# EAGLE design RelaisAdOn (EAGLE 8.4.3)
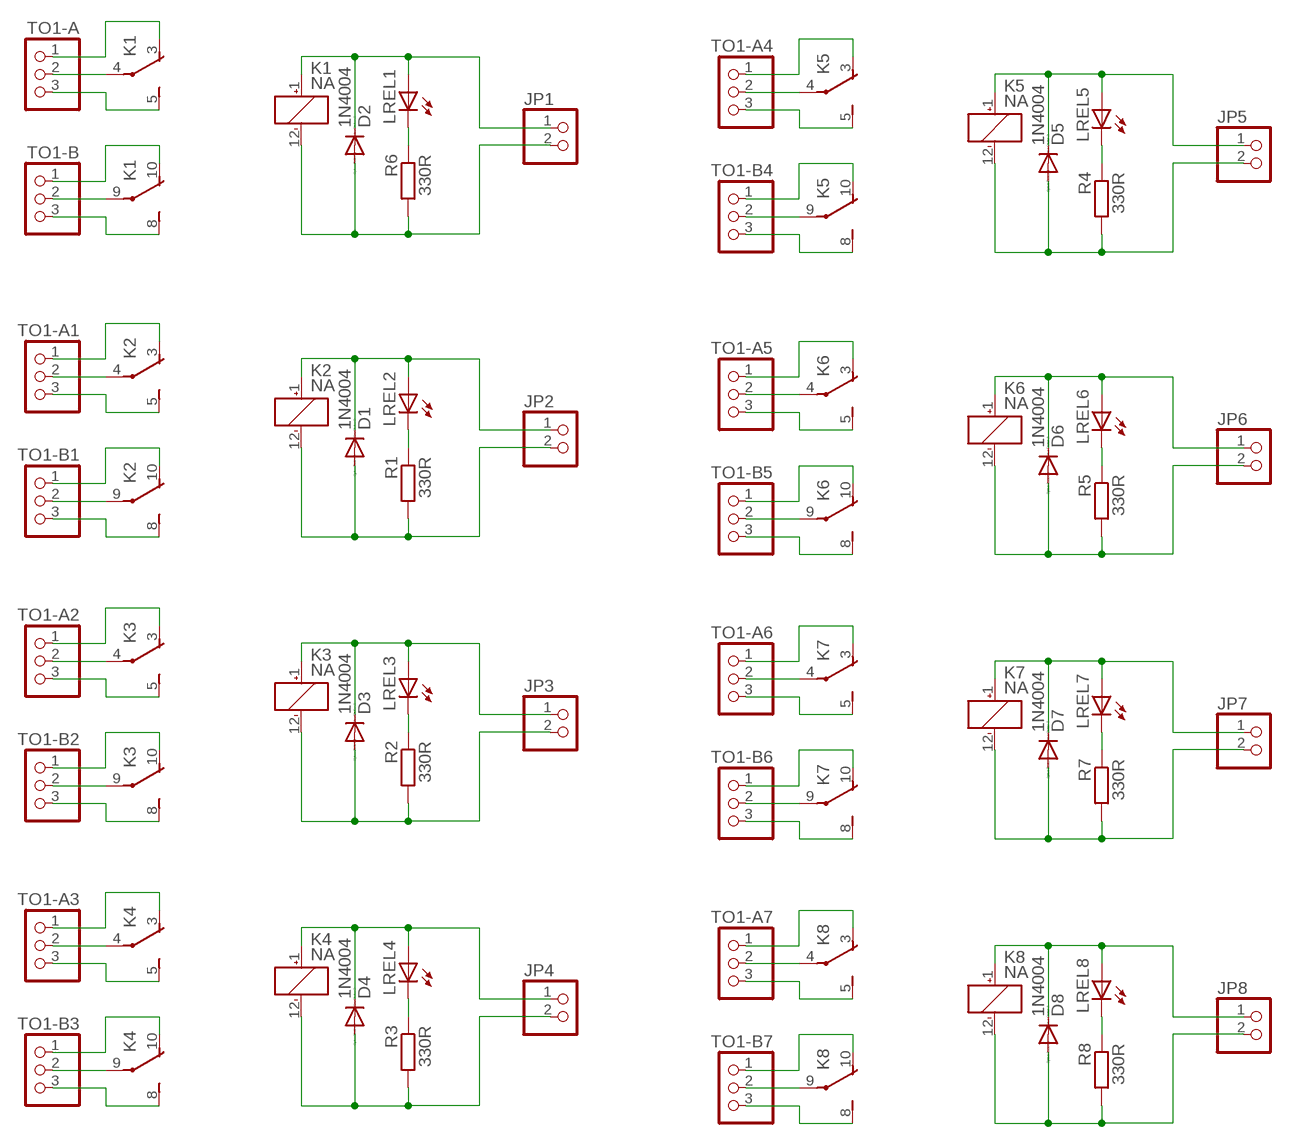
[diagram p0: schematic, sheet 1]

## Parts
D1  1N4004  [DO41-10]
D2  1N4004  [DO41-10]
D3  1N4004  [DO41-10]
D4  1N4004  [DO41-10]
D5  1N4004  [DO41-10]
D6  1N4004  [DO41-10]
D7  1N4004  [DO41-10]
D8  1N4004  [DO41-10]
JP1  PINHD-1X2  [1X02]
JP2  PINHD-1X2  [1X02]
JP3  PINHD-1X2  [1X02]
JP4  PINHD-1X2  [1X02]
JP5  PINHD-1X2  [1X02]
JP6  PINHD-1X2  [1X02]
JP7  PINHD-1X2  [1X02]
JP8  PINHD-1X2  [1X02]
K1  NA  [NA]
K2  NA  [NA]
K3  NA  [NA]
K4  NA  [NA]
K5  NA  [NA]
K6  NA  [NA]
K7  NA  [NA]
K8  NA  [NA]
LREL1  LED3MM  [LED3MM]
LREL2  LED3MM  [LED3MM]
LREL3  LED3MM  [LED3MM]
LREL4  LED3MM  [LED3MM]
LREL5  LED3MM  [LED3MM]
LREL6  LED3MM  [LED3MM]
LREL7  LED3MM  [LED3MM]
LREL8  LED3MM  [LED3MM]
R1  330R  R-EU_0207/7  [0207/7]
R2  330R  R-EU_0207/7  [0207/7]
R3  330R  R-EU_0207/7  [0207/7]
R4  330R  R-EU_0207/7  [0207/7]
R5  330R  R-EU_0207/7  [0207/7]
R6  330R  R-EU_0207/7  [0207/7]
R7  330R  R-EU_0207/7  [0207/7]
R8  330R  R-EU_0207/7  [0207/7]
TO1-A  PINHD-1X3  [1X03]
TO1-A1  PINHD-1X3  [1X03]
TO1-A2  PINHD-1X3  [1X03]
TO1-A3  PINHD-1X3  [1X03]
TO1-A4  PINHD-1X3  [1X03]
TO1-A5  PINHD-1X3  [1X03]
TO1-A6  PINHD-1X3  [1X03]
TO1-A7  PINHD-1X3  [1X03]
TO1-B  PINHD-1X3  [1X03]
TO1-B1  PINHD-1X3  [1X03]
TO1-B2  PINHD-1X3  [1X03]
TO1-B3  PINHD-1X3  [1X03]
TO1-B4  PINHD-1X3  [1X03]
TO1-B5  PINHD-1X3  [1X03]
TO1-B6  PINHD-1X3  [1X03]
TO1-B7  PINHD-1X3  [1X03]

## Nets
N$1 [Rijstroom+]: K1.4(2:P) TO1-A.2
N$2: LREL1.K(C) R6.1
N$3 [Rijstroom+]: K1.9(3:P) TO1-B.2
N$4 [Rijstroom+]: K1.8(3:S) TO1-B.3
N$5 [Rijstroom+]: K1.10(3:O) TO1-B.1
N$6 [Rijstroom+]: K1.3(2:O) TO1-A.1
N$7 [Rijstroom+]: K1.5(2:S) TO1-A.3
N$8: D2.A JP1.2 K1.12(1:-) R6.2
N$9 [5V]: D2.C JP1.1 K1.1(1:+) LREL1.A
N$10: LREL2.K(C) R1.1
N$11: D1.A JP2.2 K2.12(1:-) R1.2
N$12 [5V]: D1.C JP2.1 K2.1(1:+) LREL2.A
N$13 [Rijstroom+]: K2.4(2:P) TO1-A1.2
N$14 [Rijstroom+]: K2.9(3:P) TO1-B1.2
N$15 [Rijstroom+]: K2.8(3:S) TO1-B1.3
N$16 [Rijstroom+]: K2.10(3:O) TO1-B1.1
N$17 [Rijstroom+]: K2.3(2:O) TO1-A1.1
N$18 [Rijstroom+]: K2.5(2:S) TO1-A1.3
N$19: LREL3.K(C) R2.1
N$20: D3.A JP3.2 K3.12(1:-) R2.2
N$21 [5V]: D3.C JP3.1 K3.1(1:+) LREL3.A
N$22 [Rijstroom+]: K3.4(2:P) TO1-A2.2
N$23 [Rijstroom+]: K3.9(3:P) TO1-B2.2
N$24 [Rijstroom+]: K3.8(3:S) TO1-B2.3
N$25 [Rijstroom+]: K3.10(3:O) TO1-B2.1
N$26 [Rijstroom+]: K3.3(2:O) TO1-A2.1
N$27 [Rijstroom+]: K3.5(2:S) TO1-A2.3
N$28: LREL4.K(C) R3.1
N$29: D4.A JP4.2 K4.12(1:-) R3.2
N$30 [5V]: D4.C JP4.1 K4.1(1:+) LREL4.A
N$31 [Rijstroom+]: K4.4(2:P) TO1-A3.2
N$32 [Rijstroom+]: K4.9(3:P) TO1-B3.2
N$33 [Rijstroom+]: K4.8(3:S) TO1-B3.3
N$34 [Rijstroom+]: K4.10(3:O) TO1-B3.1
N$35 [Rijstroom+]: K4.3(2:O) TO1-A3.1
N$36 [Rijstroom+]: K4.5(2:S) TO1-A3.3
N$37: LREL5.K(C) R4.1
N$38: D5.A JP5.2 K5.12(1:-) R4.2
N$39 [5V]: D5.C JP5.1 K5.1(1:+) LREL5.A
N$40 [Rijstroom+]: K5.4(2:P) TO1-A4.2
N$41 [Rijstroom+]: K5.9(3:P) TO1-B4.2
N$42 [Rijstroom+]: K5.8(3:S) TO1-B4.3
N$43 [Rijstroom+]: K5.10(3:O) TO1-B4.1
N$44 [Rijstroom+]: K5.3(2:O) TO1-A4.1
N$45 [Rijstroom+]: K5.5(2:S) TO1-A4.3
N$46: LREL6.K(C) R5.1
N$47: D6.A JP6.2 K6.12(1:-) R5.2
N$48 [5V]: D6.C JP6.1 K6.1(1:+) LREL6.A
N$49 [Rijstroom+]: K6.4(2:P) TO1-A5.2
N$50 [Rijstroom+]: K6.9(3:P) TO1-B5.2
N$51 [Rijstroom+]: K6.8(3:S) TO1-B5.3
N$52 [Rijstroom+]: K6.10(3:O) TO1-B5.1
N$53 [Rijstroom+]: K6.3(2:O) TO1-A5.1
N$54 [Rijstroom+]: K6.5(2:S) TO1-A5.3
N$55: LREL7.K(C) R7.1
N$56: D7.A JP7.2 K7.12(1:-) R7.2
N$57 [5V]: D7.C JP7.1 K7.1(1:+) LREL7.A
N$58 [Rijstroom+]: K7.4(2:P) TO1-A6.2
N$59 [Rijstroom+]: K7.9(3:P) TO1-B6.2
N$60 [Rijstroom+]: K7.8(3:S) TO1-B6.3
N$61 [Rijstroom+]: K7.10(3:O) TO1-B6.1
N$62 [Rijstroom+]: K7.3(2:O) TO1-A6.1
N$63 [Rijstroom+]: K7.5(2:S) TO1-A6.3
N$64: LREL8.K(C) R8.1
N$65: D8.A JP8.2 K8.12(1:-) R8.2
N$66 [5V]: D8.C JP8.1 K8.1(1:+) LREL8.A
N$67 [Rijstroom+]: K8.4(2:P) TO1-A7.2
N$68 [Rijstroom+]: K8.9(3:P) TO1-B7.2
N$69 [Rijstroom+]: K8.8(3:S) TO1-B7.3
N$70 [Rijstroom+]: K8.10(3:O) TO1-B7.1
N$71 [Rijstroom+]: K8.3(2:O) TO1-A7.1
N$72 [Rijstroom+]: K8.5(2:S) TO1-A7.3

## Library data of the parts
D1-D8 = diode:1N4004: DIODE general purpose rectifier, 1 A
JP1-JP8 = pinhead:PINHD-1X2: PIN HEADER
K1-K8 = relay:NA: RELAY; OC_FARNELL: unknown; OC_NEWARK: unknown
LREL1-LREL8 = led:LED: LED OSRAM: - CHIPLED LG R971, LG N971, LY N971, LG Q971, LY Q971, LO R971, LY R971 LH N974, LH R974 LS Q976, LO Q976, LY Q976 LO Q996 - Hyper CHIPLED LW Q18S LB Q993, LB Q99A, LB R99A - SideLED LS A670, LO A670, LY A670, LG A670, LP A670 LB A673, LV A673, LT A673, LW A673 LH A674 LY A675 LS A676, LA A676, LO A676, LY A676, LW A676 LS A679, LY A679, LG A679 - Hyper Micro SIDELED® LS Y876, LA Y876, LO Y876, LY Y876 LT Y87S - SmartLED LW L88C, LW L88S LB L89C, LB L89S, LG L890 LS L89K, LO L89K, LY L89K LS L896, LA L896, LO L896, LY L896 - TOPLED LS T670, LO T670, LY T670, LG T670, LP T670 LSG T670, LSP T670, LSY T670, LOP T670, LYG T670 LG T671, LOG T671, LSG T671 LB T673, LV T673, LT T673, LW T673 LH T674 LS T676, LA T676, LO T676, LY T676, LB T676, LH T676, LSB T676, LW T676 LB T67C, LV T67C, LT T67C, LS T67K, LO T67K, LY T67K, LW E67C LS E67B, LA E67B, LO E67B, LY E67B, LB E67C, LV E67C, LT E67C LW T67C LS T679, LY T679, LG T679 LS T770, LO T770, LY T770, LG T770, LP T770 LB T773, LV T773, LT T773, LW T773 LH T774 LS E675, LA E675, LY E675, LS T675 LS T776, LA T776, LO T776, LY T776, LB T776 LHGB T686 LT T68C, LB T68C - Hyper Mini TOPLED® LB M676 - Mini TOPLED Santana® LG M470 LS M47K, LO M47K, LY M47K Source: http://www.osram.convergy.de LUXEON: - LUMILED® LXK2-PW12-R00, LXK2-PW12-S00, LXK2-PW14-U00, LXK2-PW14-V00 LXK2-PM12-R00, LXK2-PM12-S00, LXK2-PM14-U00 LXK2-PE12-Q00, LXK2-PE12-R00, LXK2-PE12-S00, LXK2-PE14-T00, LXK2-PE14-U00 LXK2-PB12-K00, LXK2-PB12-L00, LXK2-PB12-M00, LXK2-PB14-N00, LXK2-PB14-P00, LXK2-PB14-Q00 LXK2-PR12-L00, LXK2-PR12-M00, LXK2-PR14-Q00, LXK2-PR14-R00 LXK2-PD12-Q00, LXK2-PD12-R00, LXK2-PD12-S00 LXK2-PH12-R00, LXK2-PH12-S00 LXK2-PL12-P00, LXK2-PL12-Q00, LXK2-PL12-R00 Source: www.luxeon.com KINGBRIGHT: KA-3528ASYC Source: www.kingbright.com
R1-R8 = resistor:R-EU_: RESISTOR, European symbol
TO1-A TO1-A1-TO1-A7 TO1-B TO1-B1-TO1-B7 = pinhead:PINHD-1X3: PIN HEADER

## Net classes
0 default: width 0.635 mm, clearance 0.254 mm
1 5V: width 0.762 mm, clearance 0.254 mm
2 Gnd: width 0.762 mm, clearance 0.254 mm
4 Rijstroom+: width 1.016 mm, clearance 0.254 mm
6 Rijstroom-: width 1.016 mm, clearance 0.254 mm

## Board
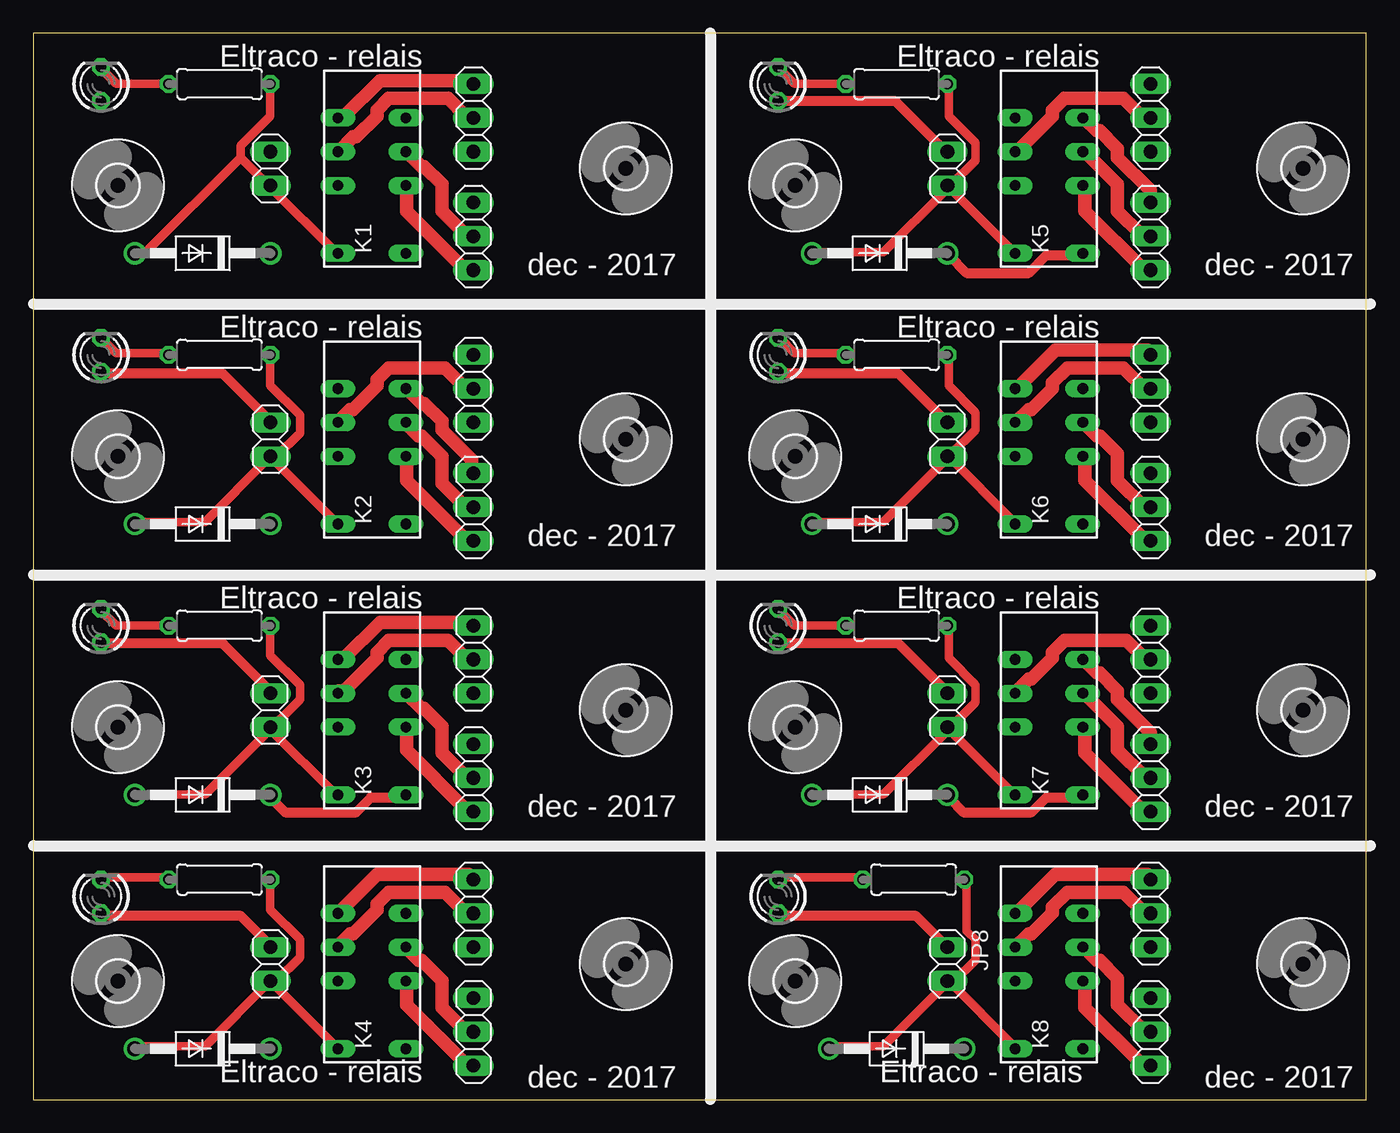
[diagram p1: board, top side]
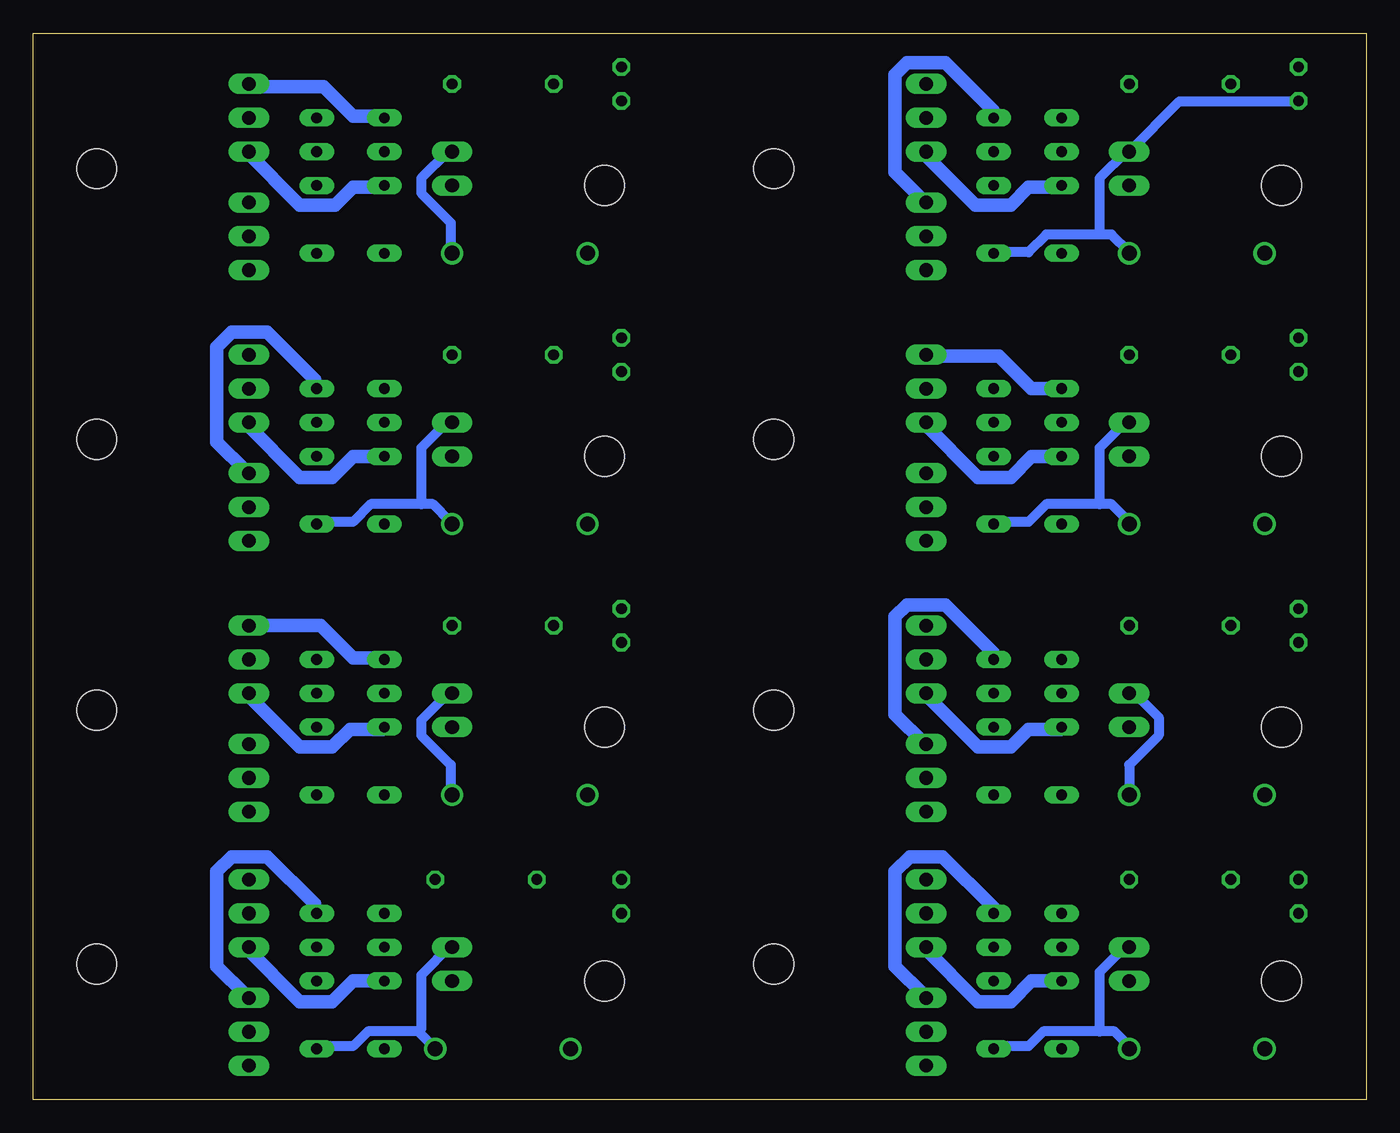
[diagram p2: board, bottom side, seen from below]

Size 100 x 80 mm. Coordinates in mm from the lower left corner, seen from the top.
Outline: 0,0 100,0 100,80 0,80 0,0
Copper layers (1*16): Top 0.035mm / dielectric 1.5mm / Bottom 0.035mm
Design rules "default": minimum track width 6mil, minimum drill 0.35mm, track to track 6mil, track to pad 6mil, pad to pad 6mil, via to via 6mil, smd to smd 6mil, copper to edge 40mil, drill to drill 6mil, minimum pad ring 10mil, minimum via ring 8mil, stop-mask expansion 4mil, vias tented up to drill 0mil, thermal gap 10mil

### Footprints (pad centres in the part's own frame; a part is rotated, then mirrored left to right if it is on the bottom)
DO41-10 = drill 1.118: A 5.08,0; C -5.08,0
1X02 = drill 1.016 long: 1 -1.27,0; 2 1.27,0
NA = drill 0.8 long: 1 -6.35,-2.54; 3 -1.27,-2.54; 4 1.27,-2.54; 5 3.81,-2.54; 8 3.81,2.54; 9 1.27,2.54; 10 -1.27,2.54; 12 -6.35,2.54
LED3MM = drill 0.813 octagon: A -1.27,0; K 1.27,0
0207/7 = drill 0.813 octagon: 1 -3.81,0; 2 3.81,0
1X03 = drill 1.016 long: 1 -2.54,0; 2 0,0; 3 2.54,0
3,0 = hole 3: 0,0

### Placement (x,y rotation side)
D1  12.7,43.18 180 top
D2  12.7,63.5 180 top
D3  12.7,22.86 180 top
D4  12.7,3.81 180 top
D5  63.5,63.5 180 top
D6  63.5,43.18 180 top
D7  63.5,22.86 180 top
D8  64.77,3.81 180 top
JP1  17.78,69.85 270 top
JP2  17.78,49.53 270 top
JP3  17.78,29.21 270 top
JP4  17.78,10.16 270 top
JP5  68.58,69.85 270 top
JP6  68.58,49.53 270 top
JP7  68.58,29.21 270 top
JP8  68.58,10.16 270 top
K1  25.4,69.85 90 top
K2  25.4,49.53 90 top
K3  25.4,29.21 90 top
K4  25.4,10.16 90 top
K5  76.2,69.85 90 top
K6  76.2,49.53 90 top
K7  76.2,29.21 90 top
K8  76.2,10.16 90 top
LREL1  5.08,76.2 90 top
LREL2  5.08,55.88 90 top
LREL3  5.08,35.56 90 top
LREL4  5.08,15.24 90 top
LREL5  55.88,76.2 90 top
LREL6  55.88,55.88 90 top
LREL7  55.88,35.56 90 top
LREL8  55.88,15.24 90 top
R1  13.97,55.88 0 top
R2  13.97,35.56 0 top
R3  13.97,16.51 0 top
R4  64.77,76.2 0 top
R5  64.77,55.88 0 top
R6  13.97,76.2 0 top
R7  64.77,35.56 0 top
R8  66.04,16.51 0 top
TO1-A  33.02,64.77 90 top
TO1-A1  33.02,44.45 90 top
TO1-A2  33.02,24.13 90 top
TO1-A3  33.02,5.08 90 top
TO1-A4  83.82,64.77 90 top
TO1-A5  83.82,44.45 90 top
TO1-A6  83.82,24.13 90 top
TO1-A7  83.82,5.08 90 top
TO1-B  33.02,73.66 90 top
TO1-B1  33.02,53.34 90 top
TO1-B2  33.02,33.02 90 top
TO1-B3  33.02,13.97 90 top
TO1-B4  83.82,73.66 90 top
TO1-B5  83.82,53.34 90 top
TO1-B6  83.82,33.02 90 top
TO1-B7  83.82,13.97 90 top
U$1  [3,0]  6.35,68.58 90 top
U$2  [3,0]  44.45,69.85 90 top
U$3  [3,0]  6.35,48.26 90 top
U$4  [3,0]  6.35,27.94 90 top
U$5  [3,0]  6.35,8.89 90 top
U$6  [3,0]  44.45,49.53 90 top
U$7  [3,0]  44.45,29.21 90 top
U$8  [3,0]  44.45,10.16 90 top
U$9  [3,0]  57.15,68.58 90 top
U$10  [3,0]  95.25,49.53 90 top
U$11  [3,0]  95.25,69.85 90 top
U$12  [3,0]  95.25,29.21 90 top
U$13  [3,0]  57.15,48.26 90 top
U$14  [3,0]  95.25,10.16 90 top
U$15  [3,0]  57.15,27.94 90 top
U$16  [3,0]  57.15,8.89 90 top

### Tracks (layer width: path | path; a pad name or v marks a point on that pad's centre or on a via)
N$1
  Top 1.016: K1.4 28,71.12 29.11,70.01 29.34,70.01 30.67,68.67 30.67,66.67 32.45,64.9 32.89,64.9 TO1-A.2
N$2
  Top 0.635: R6.1 10,76.23 6.22,76.23 5.11,77.34 LREL1.K
N$3
  Top 1.016: K1.9 22.89,71.12 24,72.23 24.23,72.23 25.78,73.79 25.78,74.23 26.67,75.12 31.11,75.12 32.45,73.79 32.89,73.79 TO1-B.2
N$4
  Top 1.016: K1.8 22.89,73.79 23.34,73.79 26,76.45 32.67,76.45 32.89,76.23 TO1-B.3
N$5
  Bottom 1.016: K1.10 22.89,68.45 25.34,68.45 26.67,67.12 29.34,67.12 32.89,70.67 32.89,71.12 TO1-B.1
N$6
  Top 1.016: TO1-A.1 32.45,62.23 28,66.67 28,68.45 K1.3
N$7
  Bottom 1.016: K1.5 28,73.79 28,74.23 31.56,77.79 34.45,77.79 35.34,76.9 35.34,69.56 33.12,67.34 TO1-A.3
N$8
  Top 0.635: K1.12 22.67,63.56 17.78,68.45 JP1.2 17.56,68.67 15.56,70.67 | R6.2 17.78,73.79 15.56,71.56 15.56,70.67 | 15.56,70.67 8.45,63.56 7.78,63.56 D2.A
N$9
  Bottom 0.762: 20,64.9 19.11,64.9 17.78,63.56 D2.C | 20,64.9 24,64.9 25.34,63.56 27.78,63.56 K1.1 | LREL1.A 5.11,74.9 14,74.9 JP1.1 18,71.12 20,69.12 20,64.9
N$10
  Top 0.635: LREL2.K 6.22,56.01 10,56.01 R1.1
N$11
  Top 0.635: K2.12 22.67,43.34 17.78,48.23 JP2.2 | R1.2 17.78,53.56 20,51.34 20,50.01 18.22,48.23 JP2.2 | D1.A 7.78,43.34 12.89,43.34 17.56,48.01 JP2.2
N$12
  Top 0.762: LREL2.A 5.11,54.45 14.22,54.45 17.78,50.9 JP2.1
  Bottom 0.762: 20,44.67 19.11,44.67 17.78,43.34 D1.C | 20,44.67 24,44.67 25.34,43.34 27.78,43.34 K2.1 | 20,44.67 20,48.9 18.22,50.67 17.78,50.67 JP2.1
N$13
  Top 1.016: TO1-A1.2 32.45,44.45 30.67,46.23 30.67,48.23 29.11,49.78 28.89,49.78 28,50.67 K2.4
N$14
  Top 1.016: TO1-B1.2 32.45,53.34 30.89,54.9 26.67,54.9 25.78,54.01 25.78,53.56 24,51.78 23.78,51.78 22.89,50.9 K2.9
N$15
  Bottom 1.016: K2.8 25.11,53.34 27.56,55.78 32.89,55.78 TO1-B1.3
N$16
  Bottom 1.016: K2.10 22.89,48.23 25.11,48.23 26.67,46.67 29.11,46.67 33.12,50.67 TO1-B1.1
N$17
  Top 1.016: K2.3 28,48.23 28,46.45 32.45,42.01 32.89,42.01 TO1-A1.1
N$18
  Top 1.016: K2.5 28,53.34 29.11,52.23 29.34,52.23 30.67,50.9 30.67,50.23 32.89,48.01 32.89,47.12 TO1-A1.3
N$19
  Top 0.635: R2.1 6.22,35.56 5.11,36.67 LREL3.K
N$20
  Top 0.635: K3.12 22.67,22.89 17.78,27.78 JP3.2 | R2.2 17.78,33.34 20,31.11 20,30 18,28 JP3.2 | D3.A 7.78,22.89 12.89,22.89 17.56,27.56 JP3.2
N$21
  Top 0.762: K3.1 27.78,22.67 25.34,22.67 24.23,21.56 18.89,21.56 17.78,22.67 D3.C | LREL3.A 5.11,34.23 14.22,34.23 17.78,30.67 JP3.1
  Bottom 0.762: D3.C 17.78,25.11 15.56,27.34 15.56,28.67 17.34,30.45 17.78,30.45 JP3.1
N$22
  Top 1.016: K3.4 28,30.45 29.11,29.34 29.34,29.34 30.67,28 30.67,26 32.45,24.23 32.89,24.23 TO1-A2.2
N$23
  Top 1.016: K3.9 22.89,30.67 23.34,30.67 25.78,33.12 25.78,33.56 26.67,34.45 31.11,34.45 32.45,33.12 32.89,33.12 TO1-B2.2
N$24
  Top 1.016: K3.8 22.89,33.12 23.34,33.12 26,35.78 32.67,35.78 32.89,35.56 TO1-B2.3
N$25
  Bottom 1.016: K3.10 22.89,27.78 25.34,27.78 26.67,26.45 29.11,26.45 33.12,30.45 TO1-B2.1
N$26
  Top 1.016: K3.3 28,27.78 28,26.23 32.45,21.78 32.89,21.78 TO1-A2.1
N$27
  Bottom 1.016: K3.5 28,33.12 28,33.56 31.56,37.12 34.45,37.12 35.34,36.23 35.34,28.89 33.12,26.67 TO1-A2.3
N$28
  Top 0.635: LREL4.K 5.11,16.67 10,16.67 R3.1
N$29
  Top 0.635: JP4.2 K4.12 | R3.2 17.78,14.22 20,12 20,10.67 18.22,8.89 JP4.2 | JP4.2 12.89,4 7.78,4 D4.A
N$30
  Top 0.762: LREL4.A 5.11,13.78 15.56,13.78 17.78,11.56 JP4.1
  Bottom 0.762: 20,5.11 18.89,5.11 17.78,4 D4.C | 20,5.11 24.23,5.11 25.34,4 27.78,4 K4.1 | 20,5.11 20,9.56 18.22,11.34 17.78,11.34 JP4.1
N$31
  Top 1.016: K4.4 28,11.34 28.89,10.45 29.11,10.45 30.67,8.89 30.67,6.89 32.45,5.11 32.89,5.11 TO1-A3.2
N$32
  Top 1.016: K4.9 22.89,11.56 23.78,12.45 24,12.45 25.78,14.22 25.78,14.67 26.67,15.56 30.89,15.56 32.45,14 32.89,14 TO1-B3.2
N$33
  Top 1.016: K4.8 25.78,16.89 32.67,16.89 32.89,16.67 TO1-B3.3
N$34
  Bottom 1.016: K4.10 25.11,8.89 26.67,7.33 29.11,7.33 33.12,11.34 TO1-B3.1
N$35
  Top 1.016: K4.3 28,8.89 28,7.11 32.45,2.67 32.89,2.67 TO1-A3.1
N$36
  Bottom 1.016: K4.5 28,14 28,14.45 31.78,18.22 34.23,18.22 35.34,17.11 35.34,10 33.12,7.78 TO1-A3.3
N$37
  Top 0.635: LREL5.K 57.12,76.23 60.9,76.23 R4.1
N$38
  Top 0.635: K5.12 73.56,63.56 68.67,68.45 JP5.2 | R4.2 68.67,76.01 68.67,73.79 70.67,71.79 70.67,70.45 68.9,68.67 JP5.2 | D5.A 58.45,63.56 63.79,63.56 68.45,68.23 JP5.2
N$39
  Top 0.762: K5.1 78.68,63.34 76.01,63.34 74.68,62.01 70.01,62.01 68.67,63.34 D5.C | LREL5.A 56.01,74.9 64.67,74.9 68.45,71.12 JP5.1
  Bottom 0.762: JP5.1 68.9,71.12 70.9,69.12 70.9,68.01 68.67,65.79 68.67,63.56 D5.C
N$40
  Top 1.016: K5.4 78.9,71.12 81.34,68.67 81.34,66.67 83.12,64.9 83.79,64.9 TO1-A4.2
N$41
  Top 1.016: K5.9 73.79,71.12 76.45,73.79 76.45,74.23 77.34,75.12 81.79,75.12 83.12,73.79 83.79,73.79 TO1-B4.2
N$42
  Bottom 1.016: K5.8 73.79,73.79 76.01,73.79 78.23,76.01 83.79,76.01 TO1-B4.3
N$43
  Bottom 1.016: K5.10 73.79,68.45 76.01,68.45 77.34,67.12 80.01,67.12 84.01,71.12 TO1-B4.1
N$44
  Top 1.016: TO1-A4.1 83.34,62.23 78.9,66.67 78.9,68.45 K5.3
N$45
  Top 1.016: K5.5 78.9,73.56 79.79,72.68 80.01,72.68 81.34,71.34 81.34,70.67 83.79,68.23 83.79,67.34 TO1-A4.3
N$46
  Top 0.635: R5.1 60.9,56.01 57.12,56.01 56.01,57.12 LREL6.K
N$47
  Top 0.635: K6.12 73.56,43.34 68.67,48.23 JP6.2 | R5.2 68.67,55.78 68.67,53.56 70.67,51.56 70.67,50.23 68.9,48.45 JP6.2 | D6.A 58.45,43.34 63.79,43.34 68.45,48.01 JP6.2
N$48
  Top 0.762: LREL6.A 56.01,54.45 64.9,54.45 68.45,50.9 JP6.1
  Bottom 0.762: 70.9,44.67 70.01,44.67 68.67,43.34 D6.C | 70.9,44.67 74.68,44.67 76.01,43.34 78.68,43.34 K6.1 | 70.9,44.67 70.9,48.9 69.12,50.67 68.67,50.67 JP6.1
N$49
  Top 1.016: TO1-A5.2 83.34,44.45 81.34,46.45 81.34,48.45 80.01,49.78 79.79,49.78 78.9,50.67 K6.4
N$50
  Top 1.016: TO1-B5.2 83.34,53.34 81.79,54.9 77.56,54.9 76.45,53.78 76.45,53.34 74.9,51.78 74.68,51.78 73.79,50.9 K6.9
N$51
  Top 1.016: K6.8 73.79,53.34 76.68,56.23 83.57,56.23 83.79,56.01 TO1-B5.3
N$52
  Bottom 1.016: K6.10 73.79,48.23 76.01,48.23 77.56,46.67 80.01,46.67 84.01,50.67 TO1-B5.1
N$53
  Top 1.016: K6.3 78.9,48.23 78.9,46.45 83.34,42.01 83.79,42.01 TO1-A5.1
N$54
  Bottom 1.016: K6.5 78.9,53.34 78.9,54.01 82.45,57.56 85.12,57.56 86.23,56.45 86.23,49.34 84.01,47.12 TO1-A5.3
N$55
  Top 0.635: R7.1 57.12,35.56 56.01,36.67 LREL7.K
N$56
  Top 0.635: K7.12 73.56,22.89 68.67,27.78 JP7.2 | R7.2 68.67,35.56 68.67,33.12 70.67,31.11 70.67,29.78 68.9,28 JP7.2 | D7.A 58.45,22.89 63.79,22.89 68.45,27.56 JP7.2
N$57
  Top 0.762: K7.1 78.68,22.67 76.01,22.67 74.9,21.56 69.79,21.56 68.67,22.67 D7.C | LREL7.A 56.01,34.23 64.9,34.23 68.45,30.67 JP7.1
  Bottom 0.762: D7.C 68.67,22.89 68.67,25.11 70.9,27.34 70.9,28.45 68.67,30.67 JP7.1
N$58
  Top 1.016: K7.4 78.9,30.45 81.34,28 81.34,26.23 83.34,24.23 83.79,24.23 TO1-A6.2
N$59
  Top 1.016: K7.9 73.79,30.67 74.68,31.56 74.9,31.56 76.45,33.12 76.45,33.56 77.34,34.45 82.01,34.45 83.34,33.12 83.79,33.12 TO1-B6.2
N$60
  Bottom 1.016: TO1-B6.3 78.45,35.56 76.01,33.12 73.79,33.12 K7.8
N$61
  Bottom 1.016: K7.10 73.79,27.78 76.23,27.78 77.56,26.45 80.01,26.45 84.01,30.45 TO1-B6.1
N$62
  Top 1.016: K7.3 78.9,27.78 78.9,26 83.12,21.78 83.79,21.78 TO1-A6.1
N$63
  Top 1.016: K7.5 78.9,32.89 79.79,32 80.01,32 81.34,30.67 81.34,30 83.79,27.56 83.79,26.67 TO1-A6.3
N$64
  Top 0.635: LREL8.K 56.01,16.67 62.23,16.67 R8.1
N$65
  Top 0.635: K8.12 73.56,4 68.67,8.89 JP8.2 | R8.2 70.01,16.45 70.01,12.67 70.67,12 70.67,10.45 69.12,8.89 JP8.2 | D8.A 59.78,4 63.79,4 68.45,8.67 JP8.2
N$66
  Top 0.762: JP8.1 66.23,13.78 56.01,13.78 LREL8.A
  Bottom 0.762: 71.12,5.11 74.9,5.11 76.01,4 78.68,4 K8.1 | 71.12,5.11 70.01,4 D8.C | 71.12,5.11 70.9,5.33 70.9,9.34 68.67,11.56 JP8.1
N$67
  Top 1.016: K8.4 78.9,11.34 79.79,10.45 80.01,10.45 81.34,9.11 81.34,7.11 83.34,5.11 83.79,5.11 TO1-A7.2
N$68
  Top 1.016: K8.9 74.68,12.45 74.9,12.45 76.45,14 76.45,14.45 77.56,15.56 81.79,15.56 83.34,14 83.79,14 TO1-B7.2
N$69
  Top 1.016: K8.8 73.79,14 76.68,16.89 83.57,16.89 83.79,16.67 TO1-B7.3
N$70
  Bottom 1.016: K8.10 76.01,8.89 77.56,7.33 80.01,7.33 84.01,11.34 TO1-B7.1
N$71
  Top 1.016: K8.3 78.9,8.89 78.9,6.89 83.12,2.67 83.79,2.67 TO1-A7.1
N$72
  Bottom 1.016: K8.5 78.9,14 78.9,14.67 82.45,18.22 85.12,18.22 86.23,17.11 86.23,10 84.01,7.78 TO1-A7.3

### Text on the board
tNames: Eltraco - relais | Eltraco - relais | dec - 2017 | dec - 2017 | Eltraco - relais | Eltraco - relais | dec - 2017 | dec - 2017 | Eltraco - relais | Eltraco - relais | dec - 2017 | dec - 2017 | dec - 2017 | dec - 2017 | Eltraco - relais | Eltraco - relais